# Altium schematic sheet [02] - BLOCK DIAGRAM.SchDoc
size A3; DocumentNumber: 2; SheetNumber: 2; SheetTotal: 6
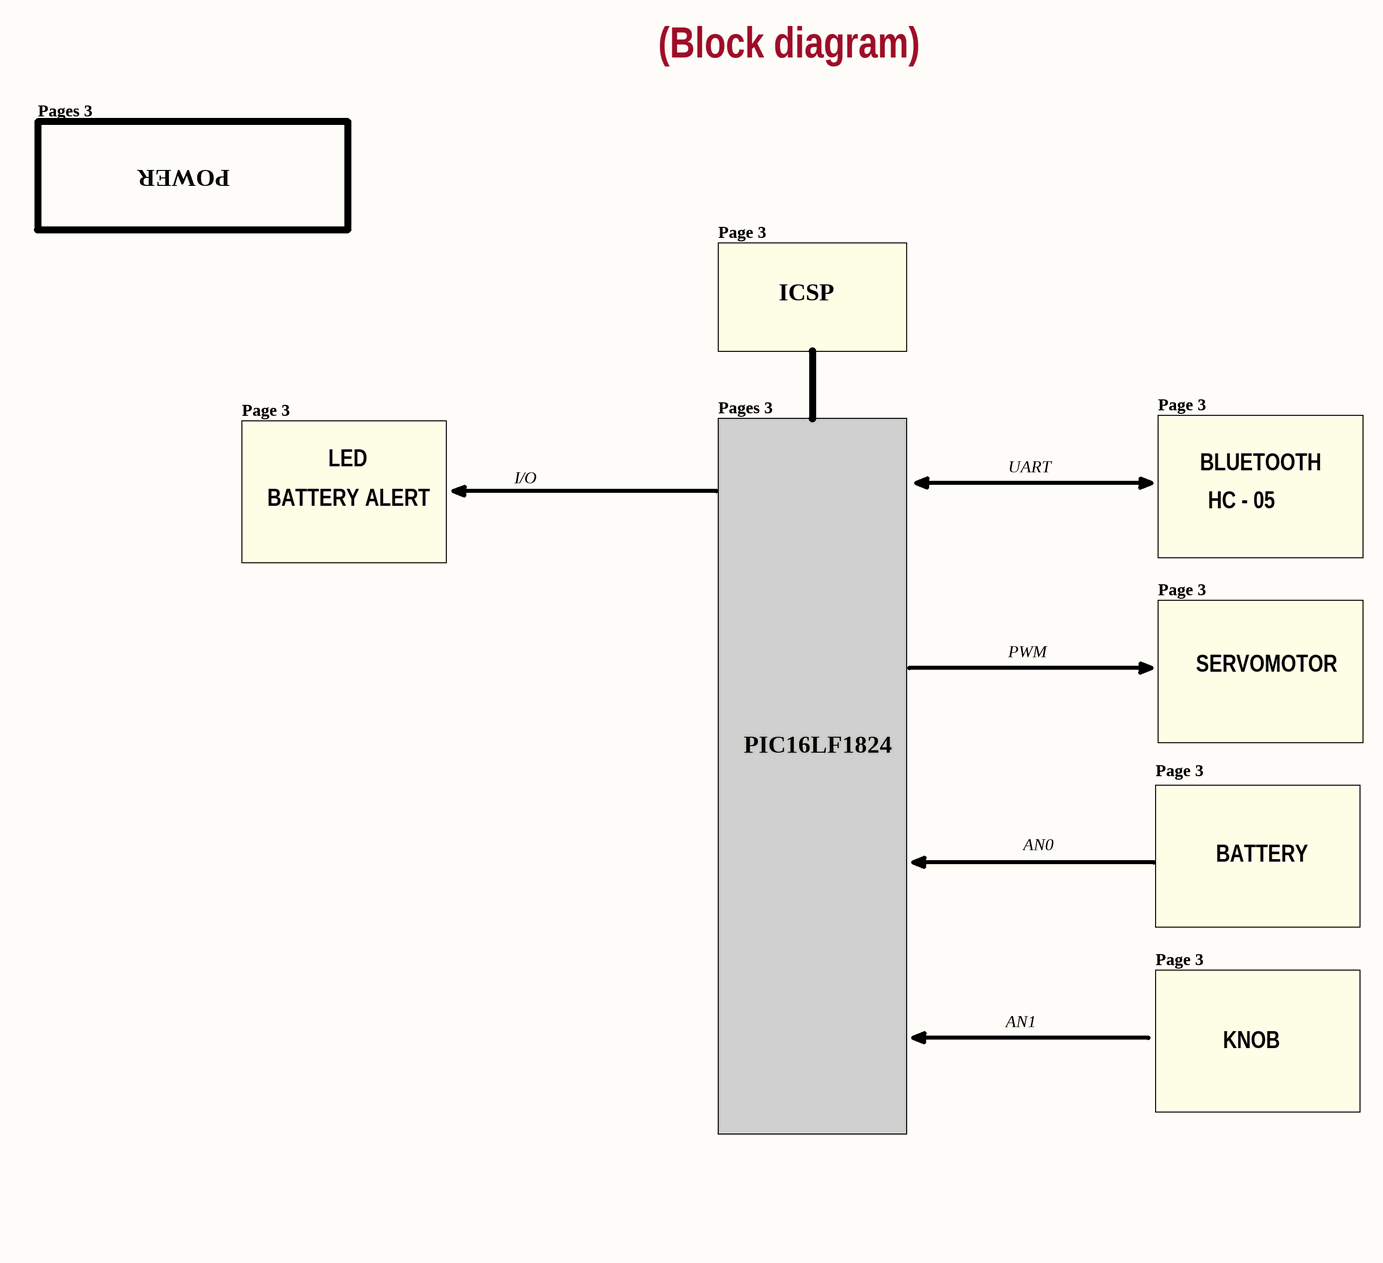
[diagram p0: [02] - BLOCK DIAGRAM.SchDoc]

## Notes on the sheet
- Pages 3
- (Block diagram)
- POWER
- Page 3
- ICSP
- BATTERY ALERT
- LED
- I/O
- UART
- BLUETOOTH
- HC - 05
- PWM
- SERVOMOTOR
- PIC16LF1824
- AN0
- BATTERY
- AN1
- KNOB
- CLOCKS (CPU & PCIE)
- Project:
- Revision:
- Engineer:
- Title:
- Pag
- of
- Embedded Things
- Date:
- Hour:
- Variant: